# Altium schematic sheet USB.SchDoc: USB
size 292 x 193 mm; SheetNumber: 6; SheetTotal: 10
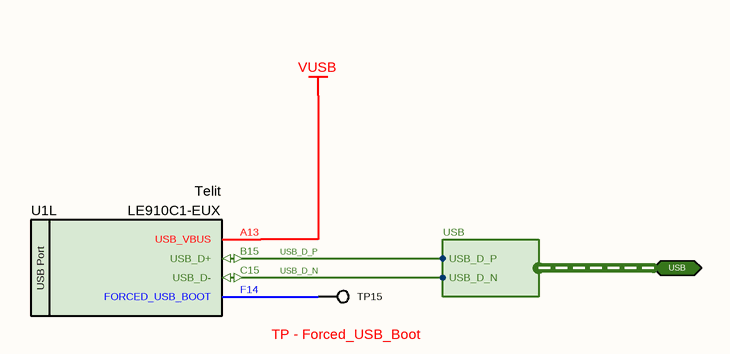
[diagram p0: USB.SchDoc]

## Parts
TP15  TP - Forced_USB_Boot  [TP]  (no BOM)
U1  Manufacturer Part Number: LE910C1-EUX  Manufacturer Name: Telit  [LE910 GSM Modem]  (hidden comment: LE910C1-EUX LTE GSM Module)  (part L of 19)

## Ports
USB (bidir, harness USB)

## Harnesses
USB: USB_D_P, USB_D_N

## Nets
VUSB: U1.A13(USB_VBUS)
USB_D_N: U1.C15(USB_D-) ; port USB.USB_D_N
USB_D_P: U1.B15(USB_D+) ; port USB.USB_D_P
NetTP15_1: TP15.1 U1.F14(FORCED_USB_BOOT)

## Notes on the sheet
- © 2026 All rights reserved.
  This document may not, in whole or in part, be copied, photocopied, reproduced, translated or converted to any electronic or machine readable from without prior written permission of Mehmet Günce Akkoyun.
  Engineer contact : akkoyun@me.com
- Property of
- Engineer :
- Date :
- Size :
- A4
- Time :
- Project :
- Page :
- /
- Customer :
- Product ID :
- Module ID :
- Version :
- File :
- Revision :
- (in symbol IC - LE910C1-EUX, part L) USB Port

## Library data of the parts
TP15 = PCB - Test Point: Test Point
U1 = IC - LE910C1-EUX: Telit LE910C1-EUX LTE/2G GSM Module; Case: BGA